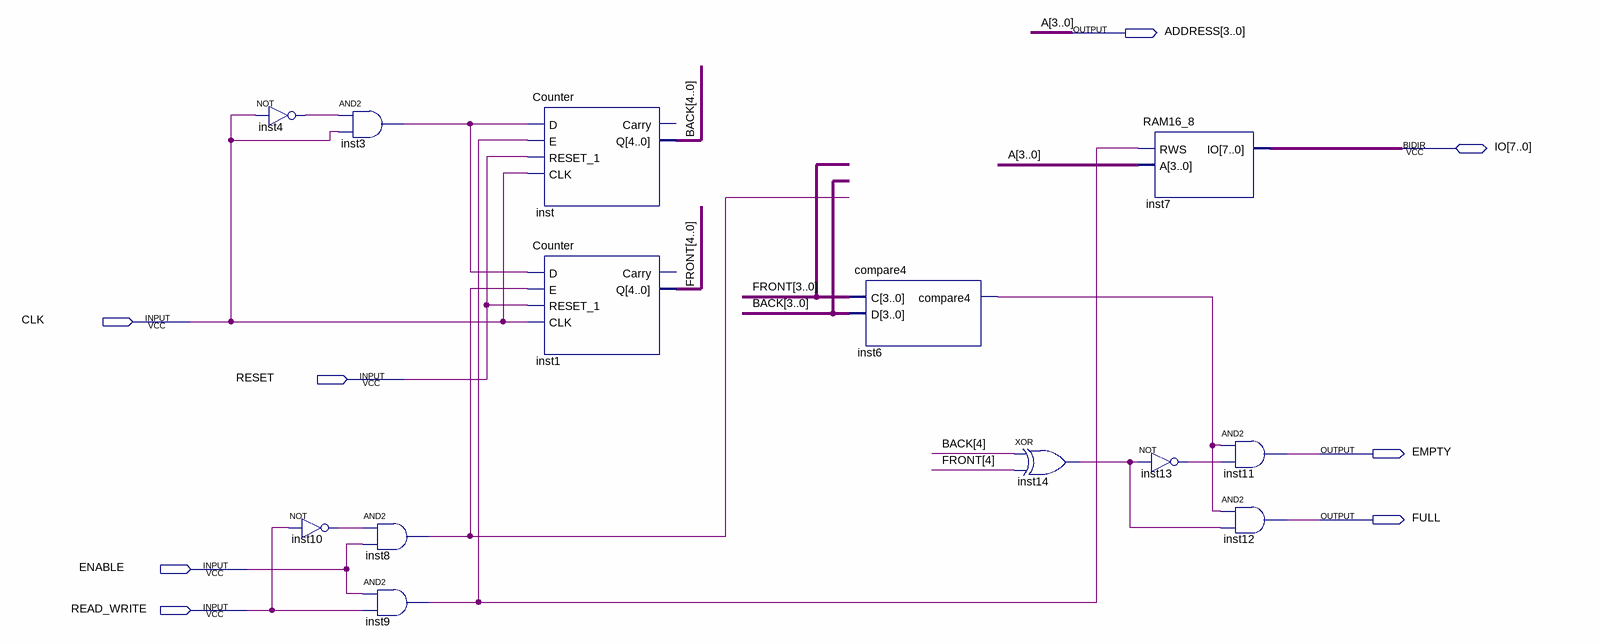
[diagram p0: schematic sheet]
// Quartus schematic FIFO.bdf as structural Verilog: 13 symbols, 8 pins
module FIFO (
  input  CLK,
  input  RESET,
  input  ENABLE,
  input  READ_WRITE,
  inout  [7:0] IO,
  output [3:0] ADDRESS,
  output EMPTY,
  output FULL
);

  wire inst3_out, inst4_out, inst6_compare4, inst8_out, inst9_out, inst10_out, inst13_out, inst14_out;
  wire [4:0] BACK, FRONT;

  not inst4 (inst4_out, CLK);
  not inst10 (inst10_out, READ_WRITE);
  and inst3 (inst3_out, inst4_out, CLK);
  and inst8 (inst8_out, inst10_out, ENABLE);
  and inst9 (inst9_out, ENABLE, READ_WRITE);
  Counter inst (.D(inst3_out), .E(inst9_out), .RESET_1(RESET), .CLK(CLK), .Q(BACK));  // open: Carry
  Counter inst1 (.D(inst3_out), .E(inst8_out), .RESET_1(RESET), .CLK(CLK), .Q(FRONT));  // open: Carry
  compare4 inst6 (.C(FRONT[3:0]), .D(BACK[3:0]), .compare4(inst6_compare4));
  xor inst14 (inst14_out, BACK[4], FRONT[4]);
  RAM16_8 inst7 (.RWS(inst9_out), .A(ADDRESS), .IO(IO));
  not inst13 (inst13_out, inst14_out);
  and inst11 (EMPTY, inst6_compare4, inst13_out);
  and inst12 (FULL, inst6_compare4, inst14_out);

  // Other names for the same wires on the sheet: A[3:0] = ADDRESS
endmodule
